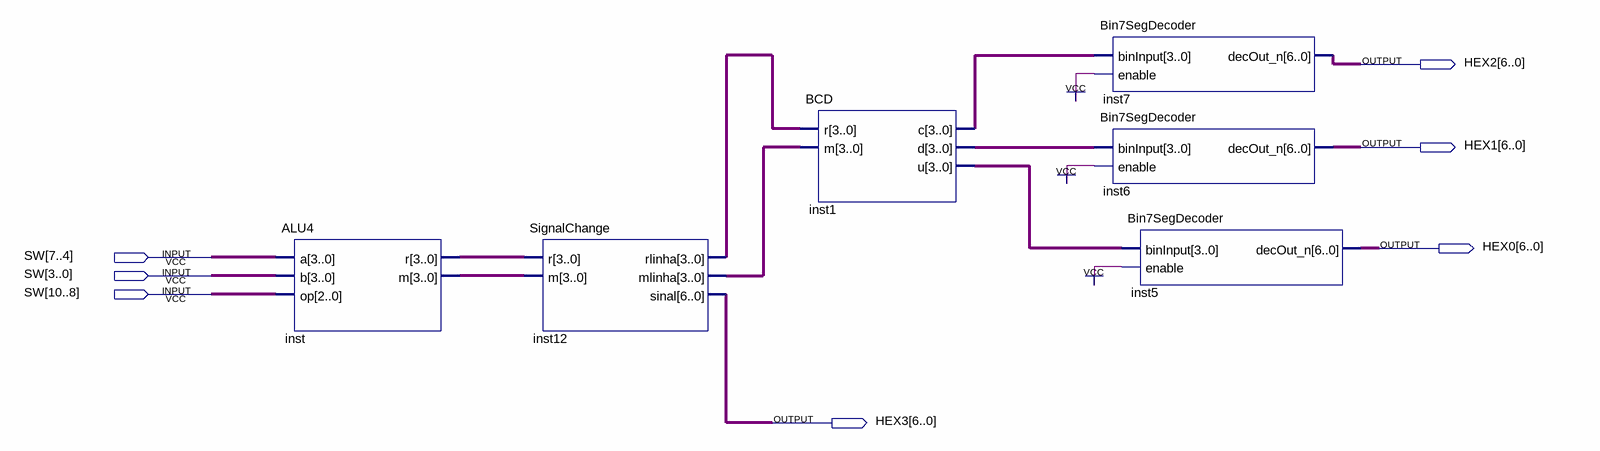
[diagram p0: schematic sheet]
// Quartus schematic ALUDemo.bdf as structural Verilog: 6 symbols, 7 pins
module ALUDemo (
  input  [10:0] SW,
  output [6:0] HEX2,
  output [6:0] HEX1,
  output [6:0] HEX0,
  output [6:0] HEX3
);

  wire [3:0] inst1_c, inst1_d, inst1_u, inst12_mlinha, inst12_rlinha, inst_m, inst_r;

  ALU4 inst (.a(SW[7:4]), .b(SW[3:0]), .op(SW[10:8]), .r(inst_r), .m(inst_m));
  SignalChange inst12 (.r(inst_r), .m(inst_m), .rlinha(inst12_rlinha), .mlinha(inst12_mlinha), .sinal(HEX3));
  BCD inst1 (.r(inst12_rlinha), .m(inst12_mlinha), .c(inst1_c), .d(inst1_d), .u(inst1_u));
  Bin7SegDecoder inst7 (.binInput(inst1_c), .enable(1'b1), .decOut_n(HEX2));
  Bin7SegDecoder inst6 (.binInput(inst1_d), .enable(1'b1), .decOut_n(HEX1));
  Bin7SegDecoder inst5 (.binInput(inst1_u), .enable(1'b1), .decOut_n(HEX0));
endmodule
